# Altium schematic sheet Sheet2.SchDoc
size 209 x 297 mm; SheetNumber: 2; SheetTotal: 3
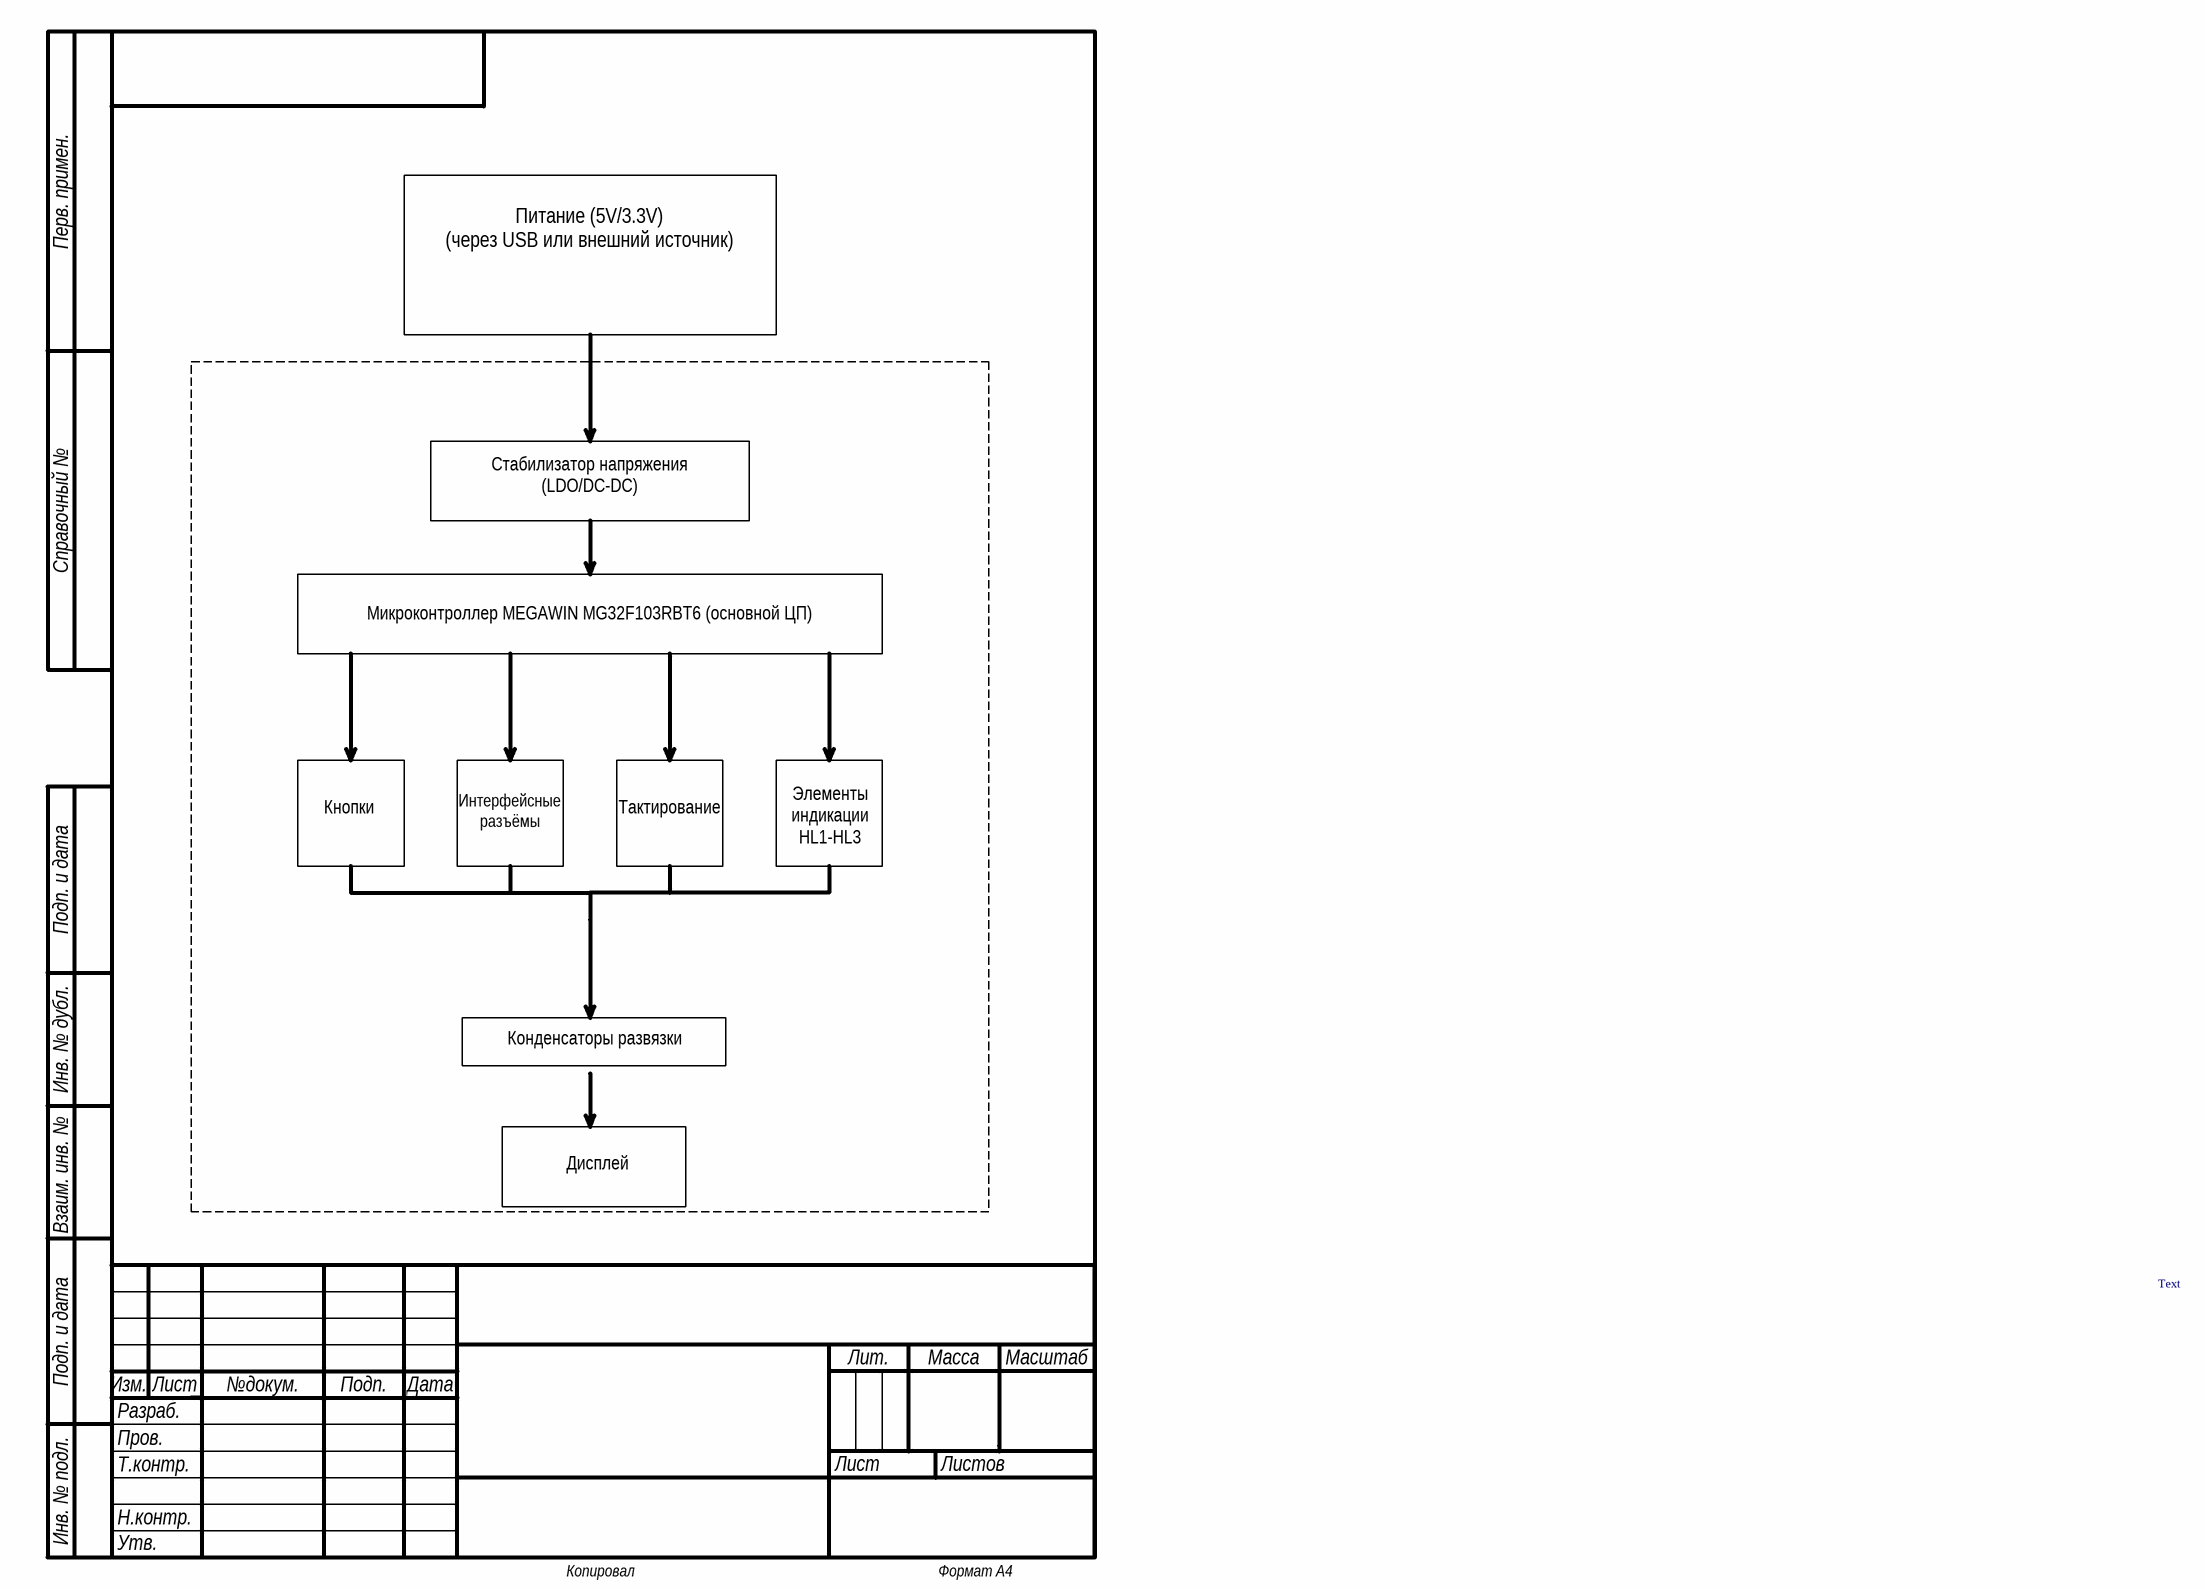
[diagram p0: Sheet2.SchDoc]

## Notes on the sheet
- Питание (5V/3.3V)                                                (через USB или внешний источник)
- Стабилизатор напряжения (LDO/DC-DC)
- Микроконтроллер MEGAWIN MG32F103RBT6 (основной ЦП)
- Кнопки
- Интерфейсные разъёмы
- Тактирование ZQ1, ZQ2
- Элементы индикации HL1-HL3
- Конденсаторы развязки
- Дисплей
- Text
- Перв. примен.
- Справочный №
- Подп. и дата
- Инв. № дубл.
- Взаим. инв. №
- Разраб.
- Изм.
- Лист
- №докум.
- Подп.
- Дата
- Лит.
- Масса
- Масштаб
- Пров.
- Т.контр.
- Листов
- Инв. № подл.
- Н.контр.
- Утв.
- Копировал
- Формат A4